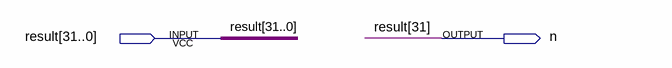
[diagram p0: schematic sheet]
// Quartus schematic uc_negative.bdf as structural Verilog: 0 symbols, 2 pins
module uc_negative (
  input  [31:0] result,
  output n
);


  assign n = result[31];
endmodule
